# EAGLE schematic motor_geared (EAGLE 5.11)
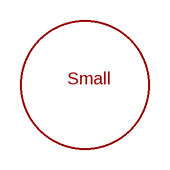
[diagram p0: schematic, sheet 1]

## Parts
GND  SLOT_SM  [SLOT_SM]

## Library data of the parts
GND = NSL_MiniQuad:SLOT_SM